# EAGLE design driver (EAGLE 9.5.2)
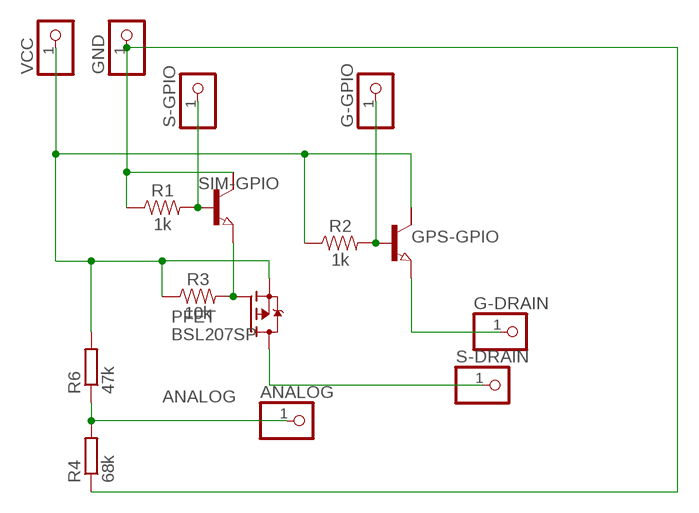
[diagram p0: schematic, sheet 1]

## Parts
ANALOG  PINHD-1X1  [1X01]
G-DRAIN  PINHD-1X1  [1X01]
G-GPIO  PINHD-1X1  [1X01]
GND  PINHD-1X1  [1X01]
GPS-GPIO  NPN-TRANSISTIOR-2COLSOT89  [SOT89]
PFET  BSL207SP  [SC74_INFINEON]
R1  1k  10KOHM-0603-1/10W-1%  [0603]
R2  1k  10KOHM-0603-1/10W-1%  [0603]
R3  10k  10KOHM-0603-1/10W-1%  [0603]
R4  68k  R-EU_0204/7  [0204/7]
R6  47k  R-EU_0204/7  [0204/7]
S-DRAIN  PINHD-1X1  [1X01]
S-GPIO  PINHD-1X1  [1X01]
SIM-GPIO  NPN-TRANSISTIOR-2COLSOT89  [SOT89]
VCC  PINHD-1X1  [1X01]

## Nets
ANALOG: ANALOG.1 R4.2 R6.1
N$1: PFET.3(G) R3.2 SIM-GPIO.3(E)
N$2: G-GPIO.1 GPS-GPIO.1(B) R2.2
N$3: GPS-GPIO.2(C) PFET.4(S) R2.1 R3.1 R6.2 VCC.1
N$4: R1.2 S-GPIO.1 SIM-GPIO.1(B)
N$5: G-DRAIN.1 GPS-GPIO.3(E)
N$6: PFET.1(D) PFET.2(D) PFET.5(D) PFET.6(D) S-DRAIN.1
N$7: GND.1 R1.1 R4.1 SIM-GPIO.2(C)
Unconnected: GPS-GPIO.2@1(C/) SIM-GPIO.2@1(C/)

## Library data of the parts
ANALOG G-DRAIN G-GPIO GND S-DRAIN S-GPIO VCC = pinhead:PINHD-1X1: PIN HEADER
GPS-GPIO SIM-GPIO = semicon-smd-ipc:NPN-TRANSISTIOR-2COL: NPN TRANSISTOR 2 colletor pins
PFET = transistor-fet:BSL207SP: OptiMOS(R)-P Small-Signal-Transistor P-Channel, Enhancement mode, Super Logic Level (2.5 V rated) Source: http://www.infineon.com/upload/Document/BSL207SP_Rev2.01.pdf
R1 R2 = SparkFun-Resistors:10KOHM: 10kΩ resistor A resistor is a passive two-terminal electrical component that implements electrical resistance as a circuit element. Resistors act to reduce current flow, and, at the same time, act to lower voltage levels within circuits. - Wikipedia; PROD_ID: RES-00824; VALUE: 10k
R3 = SparkFun-Resistors:10KOHM: 10kΩ resistor A resistor is a passive two-terminal electrical component that implements electrical resistance as a circuit element. Resistors act to reduce current flow, and, at the same time, act to lower voltage levels within circuits. - Wikipedia; PROD_ID: RES-00824
R4 R6 = resistor:R-EU_: RESISTOR, European symbol

## Board
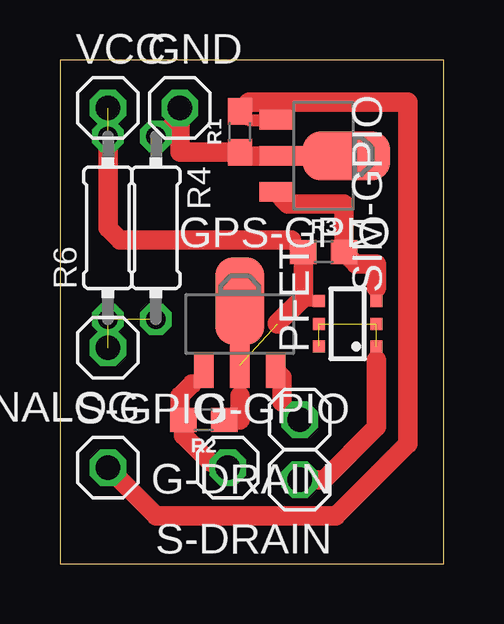
[diagram p1: board, top side]

Size 16 x 21 mm. Coordinates in mm from the lower left corner, seen from the top.
Outline: 0,0 16,0 16,21 0,21 0,0
Copper layers (1*16): Top 0.035mm / dielectric 1.5mm / Bottom 0.035mm
Design rules "default": minimum track width 6mil, minimum drill 0.35mm, track to track 6mil, track to pad 6mil, pad to pad 6mil, via to via 6mil, smd to smd 6mil, copper to edge 40mil, drill to drill 6mil, minimum pad ring 10mil, minimum via ring 8mil, stop-mask expansion 4mil, vias tented up to drill 0mil, thermal gap 10mil

### Footprints (pad centres in the part's own frame; a part is rotated, then mirrored left to right if it is on the bottom)
1X01 = drill 1.016 octagon: 1 0,0
SOT89 = smd 0.8 x 1.4: 1 -1.499,-1.981; 3 1.499,-1.981 | smd 0.8 x 1.9: 2 0,-1.727 | smd 2.032 x 3.65: 2@1 0,0.94
SC74_INFINEON = smd 0.5 x 0.5: 1 -0.95,-1.2; 2 0,-1.2; 3 0.95,-1.2; 4 0.95,1.2; 5 0,1.2; 6 -0.95,1.2
0603 = smd 1.1 x 1: 1 -0.85,0; 2 0.85,0
0204/7 = drill 0.813 octagon: 1 -3.81,0; 2 3.81,0

### Placement (x,y rotation side)
ANALOG  2,9 180 top
G-DRAIN  10,6 180 top
G-GPIO  7,4 0 top
GND  5,19 0 top
GPS-GPIO  7.5,10 0 top
PFET  12,10 90 top
R1  7.5,18 90 top
R2  6,6 180 top
R3  11,13 0 top
R4  4,14 270 top
R6  2,14 90 top
S-DRAIN  10,3.5 180 top
S-GPIO  2,4 0 top
SIM-GPIO  11,17 270 top
VCC  2,19 0 top

### Tracks (layer width: path | path; a pad name or v marks a point on that pad's centre or on a via)
ANALOG  (2 unrouted)
N$1
  Top 0.508: 13.2,11.5 PFET.3
  Top 0.813: SIM-GPIO.3 9.52,15 11.85,15 R3.2 12.35,12.5 13.2,12.5 13.2,11.5
N$2  (via drill 0.35)
  Top 0.508: GPS-GPIO.1 6,8 5.5,7.5 | 5,6.15 R2.2 | G-GPIO.1 6.5,4 6.25,4.25
  Top 0.813: 5.5,7.5 5,7 5,6.15 | R2.2 5.15,5.35 6.25,4.25
  other vias: 7,4
N$3  (2 unrouted)
  Top 0.508: 9.65,13.5 R3.1 | PFET.4 10,10.95 | 10,10.95 9.87,10.95 9.42,10.5 | GPS-GPIO.2 7.5,7 | 7.5,6 R2.1 | 10.15,11.1 10,10.95
  Top 0.813: R6.2 2,14 2.5,13.5 9.65,13.5 | R3.1 10.15,11.1 9.07,10.02 9.07,10 | 7.5,7 7.5,6
N$4
  Top 0.508: SIM-GPIO.1 7.85,18.5 R1.2 7.5,19 | 2.25,3.75 S-GPIO.1
  Top 0.813: R1.2 7.88,19.23 14.5,19.23 14.5,5 11.5,2 4,2 2.25,3.75
N$5
  Top 0.508: 9.25,6.75 G-DRAIN.1
  Top 0.813: GPS-GPIO.3 9.25,7.77 9.25,6.75
N$6  (3 unrouted)
  Top 0.508: 13.2,8.5 PFET.1
  Top 0.813: S-DRAIN.1 11,3.5 13.2,5.7 13.2,8.5
N$7
  Top 0.508: GND.1 5,18.81 R4.1 | 7,17.15 R1.1 | 9,17 SIM-GPIO.2
  Top 0.813: GND.1 5,17.15 7,17.15 | R1.1 7.65,17 9,17